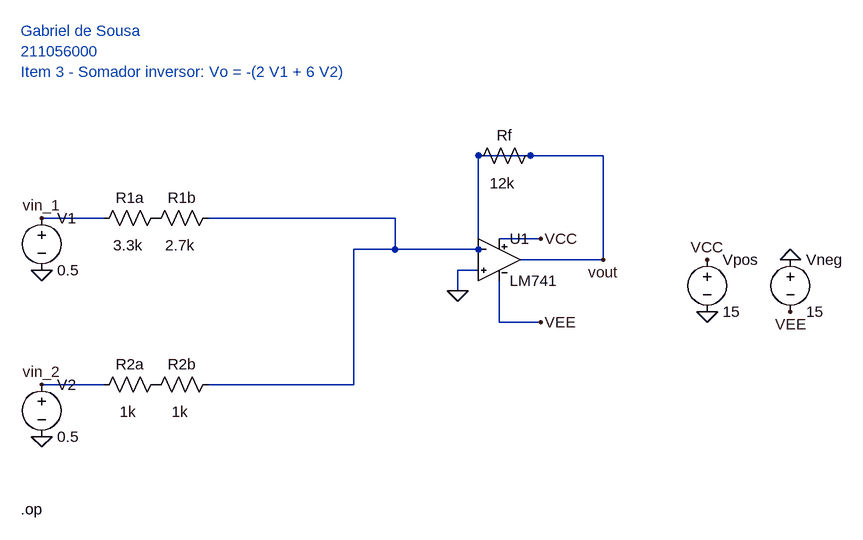
[diagram p0: schematic item_3.asc]
item_3.asc, the LTspice schematic file:
Version 4.1
SHEET 1 1400 820
WIRE 96 240 192 240
WIRE 352 240 640 240
WIRE 640 240 640 288
WIRE 640 288 768 288
WIRE 96 496 192 496
WIRE 352 496 576 496
WIRE 576 496 576 288
WIRE 576 288 640 288
WIRE 768 144 768 288
WIRE 768 144 848 144
WIRE 848 144 960 144
WIRE 960 144 960 304
WIRE 960 304 832 304
WIRE 768 320 736 320
WIRE 736 320 736 352
WIRE 800 272 864 272
WIRE 800 336 800 400
WIRE 800 400 864 400
FLAG 96 320 0
FLAG 96 240 vin_1
FLAG 96 576 0
FLAG 96 496 vin_2
FLAG 736 352 0
FLAG 864 272 VCC
FLAG 864 400 VEE
FLAG 960 304 vout
FLAG 1120 304 VCC
FLAG 1120 384 0
FLAG 1248 304 0
FLAG 1248 384 VEE
SYMBOL voltage 96 224 R0
SYMATTR InstName V1
SYMATTR Value 0.5
SYMBOL res 288 224 R90
WINDOW 0 0 56 VBottom 2
WINDOW 3 58 59 VCenter 2
SYMATTR InstName R1a
SYMATTR Value 3.3k
SYMBOL res 368 224 R90
WINDOW 0 0 56 VBottom 2
WINDOW 3 58 59 VCenter 2
SYMATTR InstName R1b
SYMATTR Value 2.7k
SYMBOL voltage 96 480 R0
SYMATTR InstName V2
SYMATTR Value 0.5
SYMBOL res 288 480 R90
WINDOW 0 0 56 VBottom 2
WINDOW 3 58 59 VCenter 2
SYMATTR InstName R2a
SYMATTR Value 1k
SYMBOL res 368 480 R90
WINDOW 0 0 56 VBottom 2
WINDOW 3 58 59 VCenter 2
SYMATTR InstName R2b
SYMATTR Value 1k
SYMBOL res 864 128 R90
WINDOW 0 0 56 VBottom 2
WINDOW 3 58 59 VCenter 2
SYMATTR InstName Rf
SYMATTR Value 12k
SYMBOL item_6 800 240 R0
SYMATTR InstName U1
SYMBOL voltage 1120 288 R0
SYMATTR InstName Vpos
SYMATTR Value 15
SYMBOL voltage 1248 288 R0
SYMATTR InstName Vneg
SYMATTR Value 15
TEXT 64 -48 Left 2 ;Gabriel de Sousa\n211056000\nItem 3 - Somador inversor: Vo = -(2 V1 + 6 V2)
TEXT 64 688 Left 2 !.op

The netlist it stands for:
* item_3.asc
V1 vin_1 0 0.5
R1a P001 vin_1 3.3k
R1b vout P001 2.7k
V2 vin_2 0 0.5
R2a P002 vin_2 1k
R2b vout P002 1k
Rf vout vout 12k
X§U1 0 vout VCC VEE vout LM741  ; pins In+ In- V+ V- OUT
Vpos VCC 0 15
Vneg 0 VEE 15
* Gabriel de Sousa
* 211056000
* Item 3 - Somador inversor: Vo = -(2 V1 + 6 V2)
.op
.lib ene0046.lib
.backanno
.end